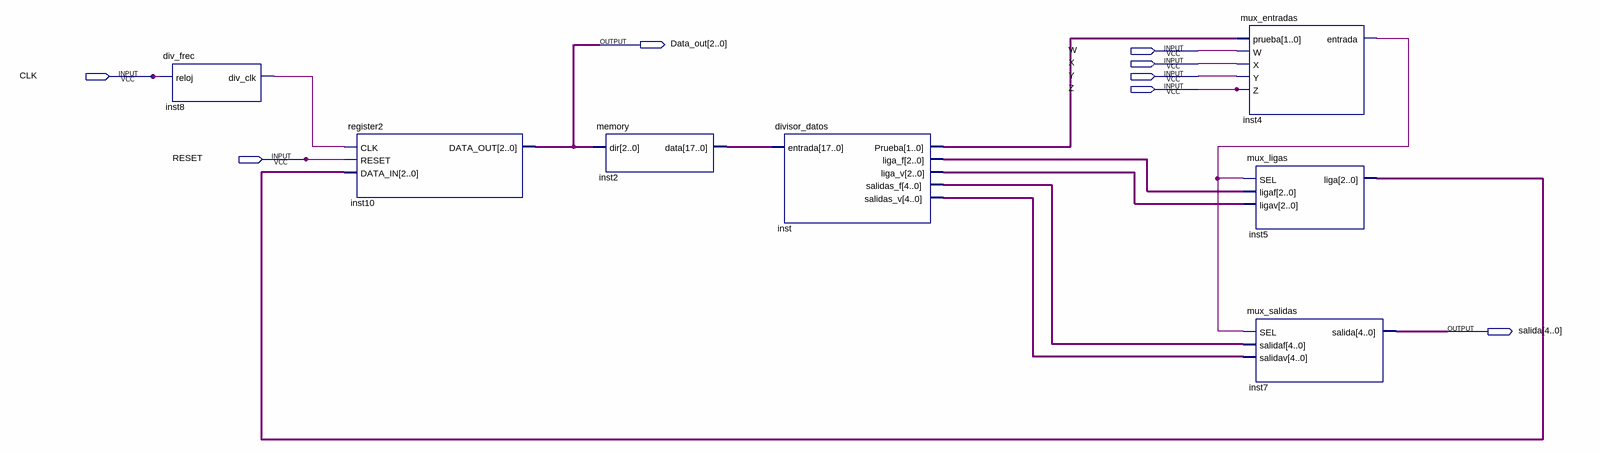
[diagram p0: schematic sheet]
// Quartus schematic Practica_4.bdf as structural Verilog: 7 symbols, 8 pins
module Practica_4 (
  input  W,
  input  X,
  input  CLK,
  input  Y,
  input  Z,
  input  RESET,
  output [2:0] Data_out,
  output [4:0] salida
);

  wire inst4_entrada, inst8_div_clk;
  wire [1:0] inst_prueba;
  wire [2:0] inst5_liga, inst_liga_f, inst_liga_v;
  wire [4:0] inst_salidas_f, inst_salidas_v;
  wire [17:0] inst2_data;

  div_frec inst8 (.reloj(CLK), .div_clk(inst8_div_clk));
  register2 inst10 (.CLK(inst8_div_clk), .RESET(RESET), .DATA_IN(inst5_liga), .DATA_OUT(Data_out));
  memory inst2 (.dir(Data_out), .data(inst2_data));
  divisor_datos inst (
    .entrada(inst2_data), .Prueba(inst_prueba), .liga_f(inst_liga_f), .liga_v(inst_liga_v),
    .salidas_f(inst_salidas_f), .salidas_v(inst_salidas_v));
  mux_entradas inst4 (.prueba(inst_prueba), .W(W), .X(X), .Y(Y), .Z(Z), .entrada(inst4_entrada));
  mux_ligas inst5 (.SEL(inst4_entrada), .ligaf(inst_liga_f), .ligav(inst_liga_v), .liga(inst5_liga));
  mux_salidas inst7 (.SEL(inst4_entrada), .salidaf(inst_salidas_f), .salidav(inst_salidas_v), .salida(salida));
endmodule
